# Altium schematic sheet ESP32Schematic[1].SchDoc (part 1 of 3)
size A; SheetNumber: 1; SheetTotal: 2
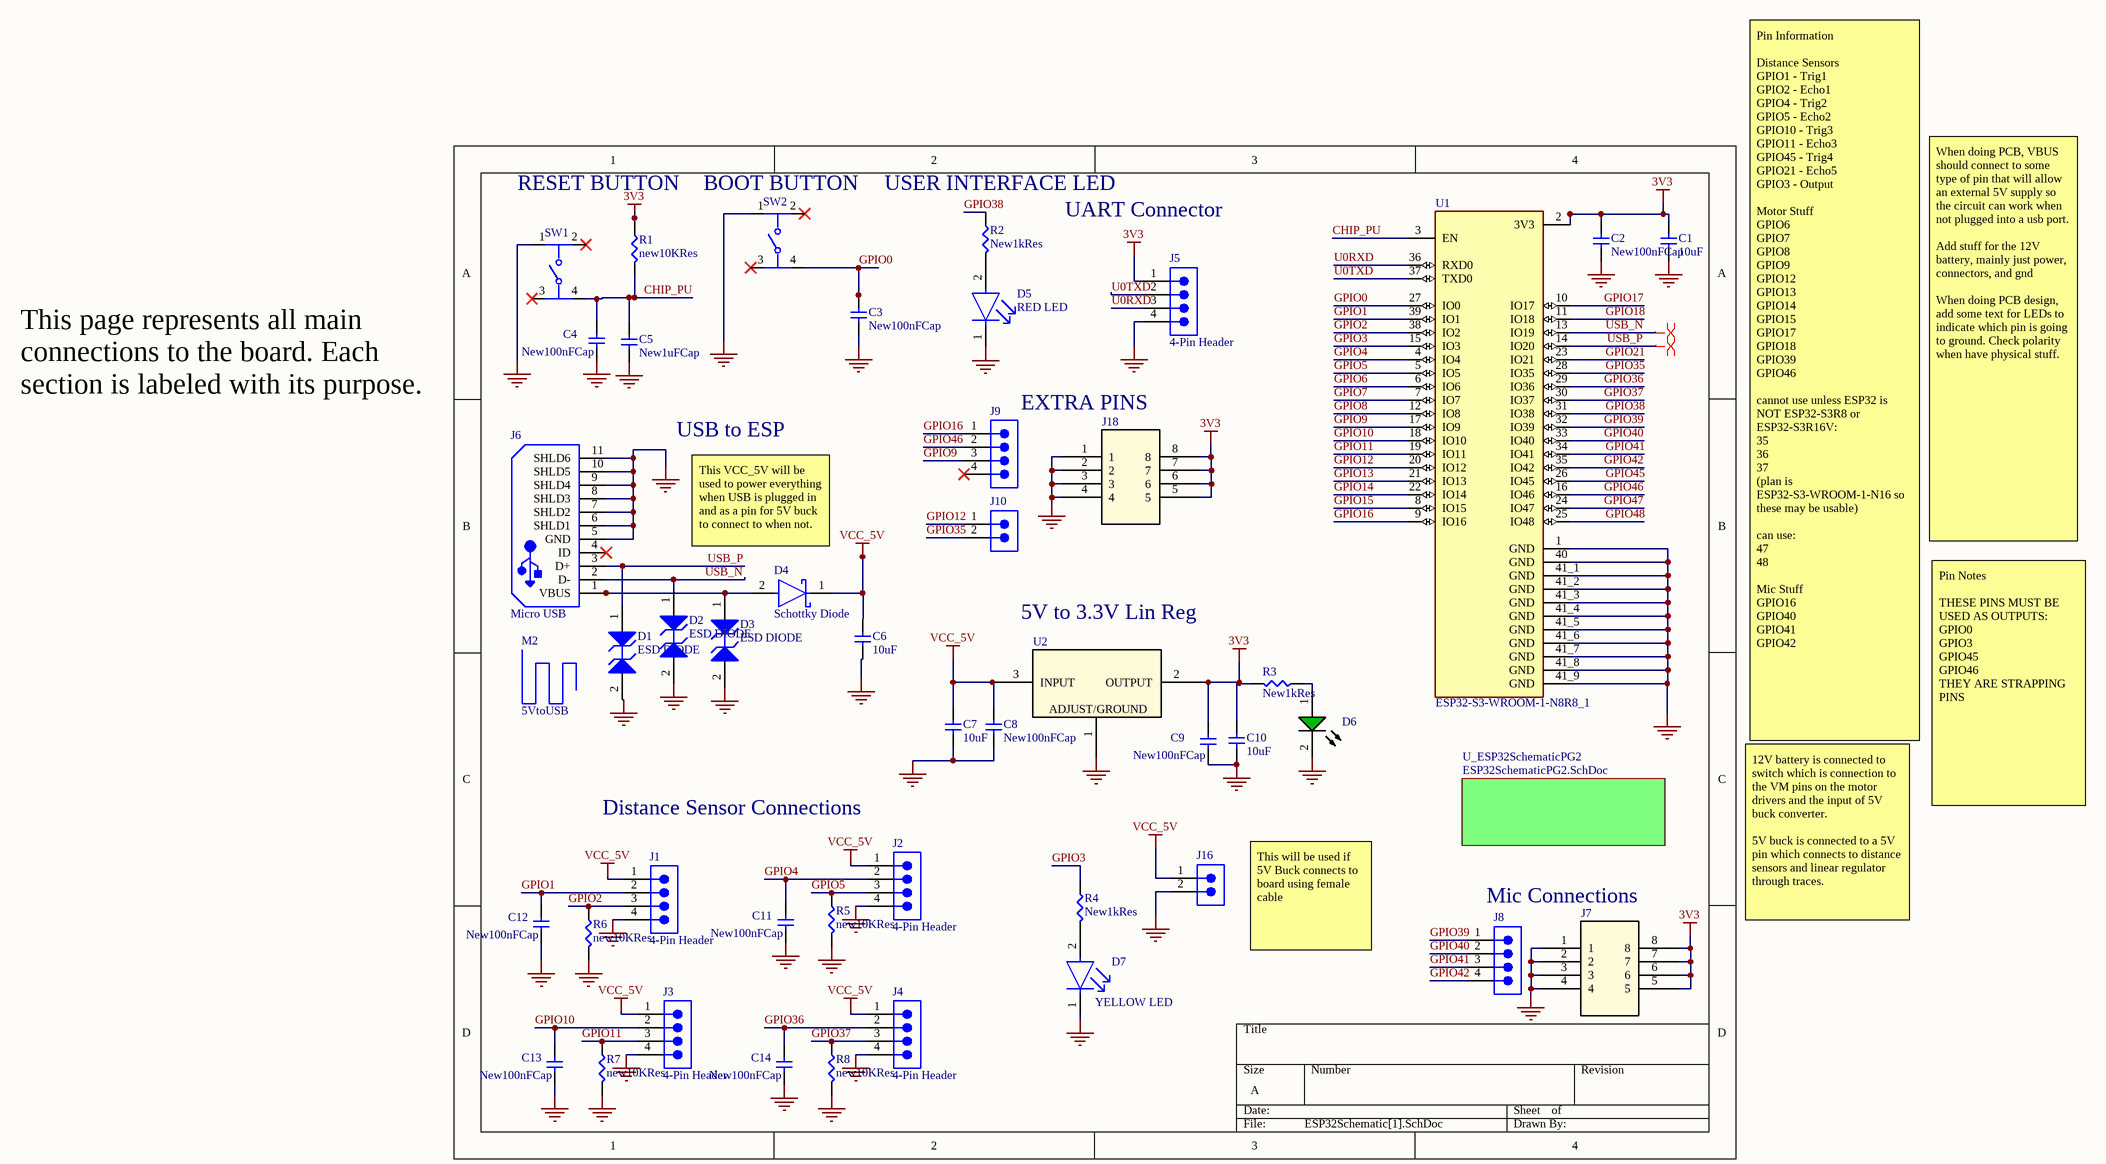
[diagram p0: ESP32Schematic[1].SchDoc]

## Parts
C1  10uF  [FP-C0805C106K3PACTU-IPC_C]
C2  New100nFCap  [FP-CC0805-0_85-MFG]
C3  New100nFCap  [FP-CC0805-0_85-MFG]
C4  New100nFCap  [FP-CC0805-0_85-MFG]
C5  New1uFCap  [CAPC2013X140X50ML20T25]
C6  10uF  [FP-C0805C106K3PACTU-IPC_C]
C7  10uF  [FP-C0805C106K3PACTU-IPC_C]
C8  New100nFCap  [FP-CC0805-0_85-MFG]
C9  New100nFCap  [FP-CC0805-0_85-MFG]
C10  10uF  [FP-C0805C106K3PACTU-IPC_C]
C11  New100nFCap  [FP-CC0805-0_85-MFG]
C12  New100nFCap  [FP-CC0805-0_85-MFG]
C13  New100nFCap  [FP-CC0805-0_85-MFG]
C14  New100nFCap  [FP-CC0805-0_85-MFG]
D1  ESD DIODE  [ONSC-SOD-923-2-514AB-01_V]
D2  ESD DIODE  [ONSC-SOD-923-2-514AB-01_V]
D3  ESD DIODE  [ONSC-SOD-923-2-514AB-01_V]
D4  Schottky Diode  [FP-SOD123-IPC_B]
D5  RED LED  [FP-HSMS-C150-MFG]
D6  GREEN LED  [AVAG-HSMX-C110_V]  (value not drawn)
D7  YELLOW LED  [LED_HSMY-C170]
J1  4-Pin Header  [61300411121]
J2  4-Pin Header  [61300411121]
J3  4-Pin Header  [61300411121]
J4  4-Pin Header  [61300411121]
J5  4-Pin Header  [61300411121]
J6  Micro USB  [FCI-10103594-0001LF_V]
J7  8pin  [TSW-104-07-G-D_SAI]  (value not drawn)
J8  4-Pin Header  [61300411121]  (value not drawn)
J9  4-Pin Header  [61300411121]  (value not drawn)
J10  2pinheader  [61300211121]  (value not drawn)
J16  2pinheader  [61300211121]  (value not drawn)
J18  8pin  [TSW-104-07-G-D_SAI]  (value not drawn)
M2  5VtoUSB  (mechanical)
R1  new10KRes  [RESC2013X60X35NL10T20]
R2  New1kRes  [RESC2013X60X35NL10T20]
R3  New1kRes  [RESC2013X60X35NL10T20]
R4  New1kRes  [RESC2013X60X35NL10T20]
R5  new10KRes  [RESC2013X60X35NL10T20]
R6  new10KRes  [RESC2013X60X35NL10T20]
R7  new10KRes  [RESC2013X60X35NL10T20]
R8  new10KRes  [RESC2013X60X35NL10T20]
SW1  PTS647SM38SMTR2LFS  [FP-PTS647SM38SMTR2LFS-MFG]  (value not drawn)
SW2  PTS647SM38SMTR2LFS  [FP-PTS647SM38SMTR2LFS-MFG]  (value not drawn)
U1  ESP32-S3-WROOM-1-N8R8_1  [XCVR_ESP32S3WROOM1N8R8]
U2  LM1117MPX-33NOPB  [SOT223-318H_OSI]  (value not drawn)

## Sub-sheets
U_ESP32SchematicPG2 = ESP32SchematicPG2.SchDoc: no entries

## Nets
3V3: C1.2 C2.2 C9.2 C10.2 J5.1 J7.5 J7.6 J7.7 J7.8 J18.5 J18.6 J18.7 J18.8 R1.1 R3.2 U1.2(3V3) U2.2(OUTPUT)
GND: C1.1 C2.1 C3.1 C4.1 C5.2 C6.1 C7.1 C8.1 C9.1 C10.1 C11.1 C12.1 C13.1 C14.1 D1.2(A2) D2.2(A2) D3.2(A2) D5.1(C) D6.2(K) D7.1(C) J1.4 J2.4 J3.4 J4.4 J5.4 J6.5(GND) J6.6(SHLD1) J6.7(SHLD2) J6.8(SHLD3) J6.9(SHLD4) J6.10(SHLD5) J6.11(SHLD6) J7.1 J7.2 J7.3 J7.4 J16.2 J18.1 J18.2 J18.3 J18.4 R5.2 R6.2 R7.2 R8.2 SW1.1 SW2.1 U1.1(GND) U1.40(GND) U1.41_1(GND) U1.41_2(GND) U1.41_3(GND) U1.41_4(GND) U1.41_5(GND) U1.41_6(GND) U1.41_7(GND) U1.41_8(GND) U1.41_9(GND) U2.1(ADJUST/GROUND)
VCC_5V: C6.2 C7.2 C8.2 D4.1(C) J1.1 J2.1 J3.1 J4.1 J16.1 U2.3(INPUT)
CHIP_PU: C4.2 C5.1 R1.2 SW1.4 U1.3(EN)
GPIO0: C3.2 SW2.4 U1.27(IO0)
GPIO1: C12.2 J1.2 U1.39(IO1)
GPIO2: J1.3 R6.1 U1.38(IO2)
GPIO3: R4.1 U1.15(IO3)
GPIO4: C11.2 J2.2 U1.4(IO4)
GPIO5: J2.3 R5.1 U1.5(IO5)
GPIO6: U1.6(IO6)
GPIO7: U1.7(IO7)
GPIO8: U1.12(IO8)
GPIO9: J9.3 U1.17(IO9)
GPIO10: C13.2 J3.2 U1.18(IO10)
GPIO11: J3.3 R7.1 U1.19(IO11)
GPIO12: J10.1 U1.20(IO12)
GPIO13: U1.21(IO13)
GPIO14: U1.22(IO14)
GPIO15: U1.8(IO15)
GPIO16: J9.1 U1.9(IO16)
GPIO17: U1.10(IO17)
GPIO18: U1.11(IO18)
GPIO21: U1.23(IO21)
GPIO35: J10.2 U1.28(IO35)
GPIO36: C14.2 J4.2 U1.29(IO36)
GPIO37: J4.3 R8.1 U1.30(IO37)
GPIO38: R2.1 U1.31(IO38)
GPIO39: J8.1 U1.32(IO39)
GPIO40: J8.2 U1.33(IO40)
GPIO41: J8.3 U1.34(IO41)
GPIO42: J8.4 U1.35(IO42)
GPIO45: U1.26(IO45)
GPIO46: J9.2 U1.16(IO46)
GPIO47: U1.24(IO47)
GPIO48: U1.25(IO48)
U0RXD: J5.3 U1.36(RXD0)
U0TXD: J5.2 U1.37(TXD0)
USB_N: D2.1(A1) J6.2(D-) U1.13(IO19)
USB_P: D1.1(A1) J6.3(D+) U1.14(IO20)
NetD3_1: D3.1(A1) D4.2(A) J6.1(VBUS)
NetD5_2: D5.2(A) R2.2
NetD6_1: D6.1(A) R3.1
NetD7_2: D7.2(A) R4.2

Not connected (* = marked no-connect by the designer): J6 4(ID)*; J9 4*; SW1 2* 3*; SW2 2* 3*

## Layout directives
differential pair; differential pair class DIFF90: USB_N, USB_P

## Notes on the sheet
- RESET BUTTON
- (near SW2) BOOT BUTTON
- (near R2) USER INTERFACE LED
- UART Connector
- USB to ESP
- EXTRA PINS
- This VCC_5V will be used to power everything when USB is plugged in and as a pin for 5V buck to connect to when not.
- When doing PCB, VBUS should connect to some type of pin that will allow an external 5V supply so the circuit can work when not plugged into a usb port.
  Add stuff for the 12V battery, mainly just power, connectors, and gnd
  When doing PCB design, add some text for LEDs to indicate which pin is going to ground. Check polarity when have physical stuff.
- 5V to 3.3V Lin Reg
- Pin Information
  Distance Sensors
  GPIO1 - Trig1
  GPIO2 - Echo1
  GPIO4 - Trig2
  GPIO5 - Echo2
  GPIO10 - Trig3
  GPIO11 - Echo3
  GPIO45 - Trig4
  GPIO21 - Echo5
  GPIO3 - Output
  Motor Stuff
  GPIO6
  GPIO7
  GPIO8
  GPIO9
  GPIO12
  GPIO13
  GPIO14
  GPIO15
  GPIO17
  GPIO18
  GPIO39
  GPIO46
  cannot use unless ESP32 is NOT ESP32-S3R8 or ESP32-S3R16V:
  35
  36
  37
  (plan is ESP32-S3-WROOM-1-N16 so these may be usable)
  can use:
  47
  48
  Mic Stuff
  GPIO16
  GPIO40
  GPIO41
  GPIO42
- This page represents all main connections to the board. Each section is labeled with its purpose.
- Distance Sensor Connections
- Pin Notes
  THESE PINS MUST BE USED AS OUTPUTS:
  GPIO0
  GPIO3
  GPIO45
  GPIO46
  THEY ARE STRAPPING PINS
- Mic Connections
- 12V battery is connected to switch which is connection to the VM pins on the motor drivers and the input of 5V buck converter.
  5V buck is connected to a 5V pin which connects to distance sensors and linear regulator through traces.
- (near J16) This will be used if 5V Buck connects to board using female cable